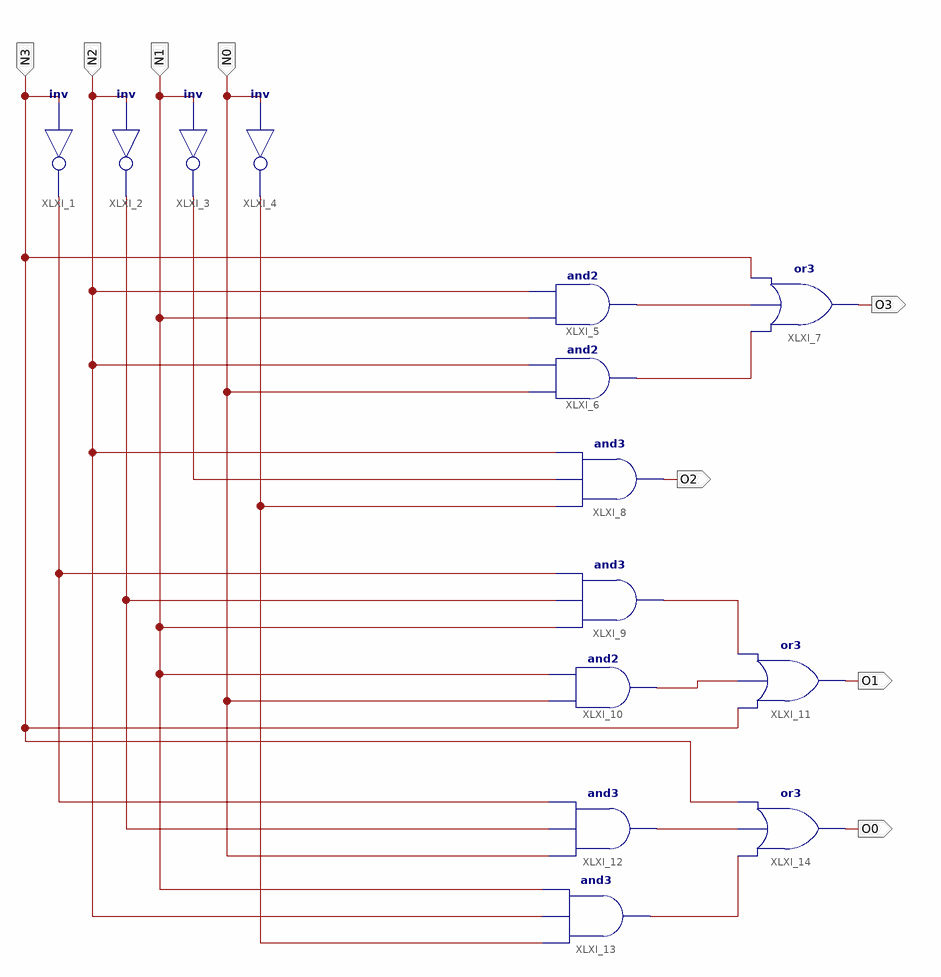
[diagram p0: schematic sheet 1]
// Xilinx ISE schematic conadder.sch (spartan6) as structural Verilog: 14 symbols, 8 ports
module conadder (
  input  N3,
  input  N2,
  input  N1,
  input  N0,
  output O3,
  output O2,
  output O1,
  output O0
);

  wire XLXN_8, XLXN_9, XLXN_10, XLXN_11, XLXN_13, XLXN_14, XLXN_15, XLXN_16, XLXN_18, XLXN_19;

  not XLXI_1 (XLXN_11, N3);
  not XLXI_2 (XLXN_10, N2);
  not XLXI_3 (XLXN_9, N1);
  not XLXI_4 (XLXN_8, N0);
  and XLXI_5 (XLXN_13, N1, N2);
  and XLXI_6 (XLXN_14, N0, N2);
  or XLXI_7 (O3, XLXN_14, XLXN_13, N3);
  and XLXI_8 (O2, XLXN_8, XLXN_9, N2);
  and XLXI_9 (XLXN_15, N1, XLXN_10, XLXN_11);
  and XLXI_10 (XLXN_16, N0, N1);
  or XLXI_11 (O1, N3, XLXN_16, XLXN_15);
  and XLXI_12 (XLXN_18, N0, XLXN_10, XLXN_11);
  and XLXI_13 (XLXN_19, XLXN_8, N2, N1);
  or XLXI_14 (O0, XLXN_19, XLXN_18, N3);
endmodule
